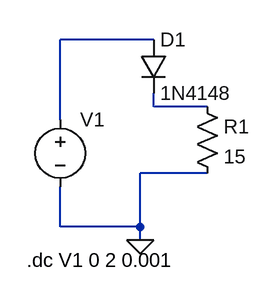
[diagram p0: schematic project_02.asc]
project_02.asc, the LTspice schematic file:
Version 4.1
SHEET 1 880 680
WIRE 160 -64 48 -64
WIRE 160 16 160 0
WIRE 224 16 160 16
WIRE 48 32 48 -64
WIRE 224 96 144 96
WIRE 48 160 48 112
WIRE 144 160 144 96
WIRE 144 160 48 160
WIRE 144 176 144 160
FLAG 144 176 0
SYMBOL voltage 48 16 R0
WINDOW 123 0 0 Left 0
WINDOW 39 0 0 Left 0
SYMATTR InstName V1
SYMATTR Value ""
SYMBOL diode 144 -64 R0
SYMATTR InstName D1
SYMATTR Value 1N4148
SYMBOL res 208 0 R0
SYMATTR InstName R1
SYMATTR Value 15
TEXT 8 200 Left 2 !.dc V1 0 2 0.001

The netlist it stands for:
* project_02.asc
V1 N001 0
D1 N001 N002 1N4148
R1 N002 0 15
.model D D
.lib standard.dio
.dc V1 0 2 0.001
.backanno
.end